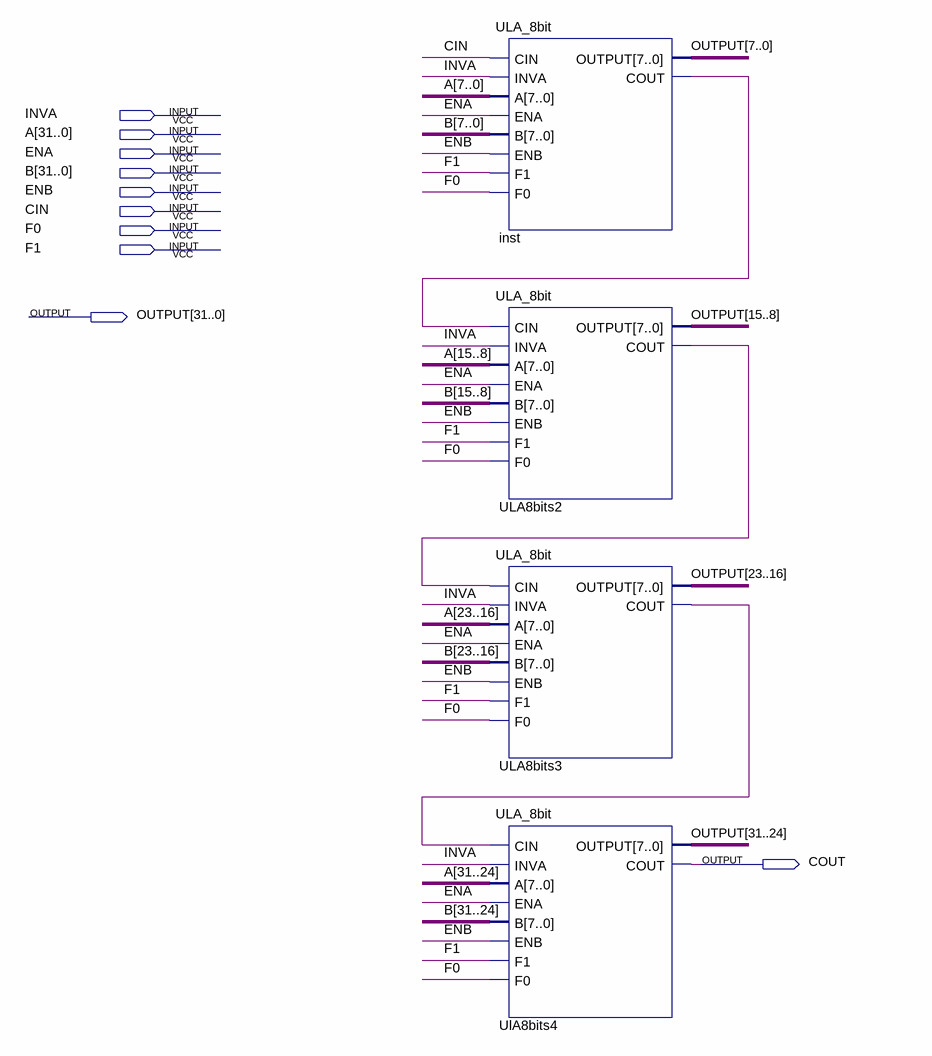
[diagram p0: schematic sheet]
// Quartus schematic ULA_32bit.bdf as structural Verilog: 4 symbols, 10 pins
module ULA_32bit (
  input  INVA,
  input  [31:0] A,
  input  ENA,
  input  [31:0] B,
  input  ENB,
  input  CIN,
  input  F0,
  input  F1,
  output [31:0] OUTPUT,
  output COUT
);

  wire inst_cout, ULA8bits2_cout, ULA8bits3_cout;

  ULA_8bit inst (
    .CIN(CIN), .INVA(INVA), .A(A[7:0]), .ENA(ENA), .B(B[7:0]), .ENB(ENB), .F1(F1), .F0(F0),
    .OUTPUT(OUTPUT[7:0]), .COUT(inst_cout));
  ULA_8bit ULA8bits2 (
    .CIN(inst_cout), .INVA(INVA), .A(A[15:8]), .ENA(ENA), .B(B[15:8]), .ENB(ENB), .F1(F1), .F0(F0),
    .OUTPUT(OUTPUT[15:8]), .COUT(ULA8bits2_cout));
  ULA_8bit ULA8bits3 (
    .CIN(ULA8bits2_cout), .INVA(INVA), .A(A[23:16]), .ENA(ENA), .B(B[23:16]), .ENB(ENB), .F1(F1), .F0(F0),
    .OUTPUT(OUTPUT[23:16]), .COUT(ULA8bits3_cout));
  ULA_8bit UlA8bits4 (
    .CIN(ULA8bits3_cout), .INVA(INVA), .A(A[31:24]), .ENA(ENA), .B(B[31:24]), .ENB(ENB), .F1(F1), .F0(F0),
    .OUTPUT(OUTPUT[31:24]), .COUT(COUT));
endmodule
